# EAGLE design mp28164-buck-boost-flashlight-driver-tester-mk-2.0.0 (EAGLE 9.2.2)
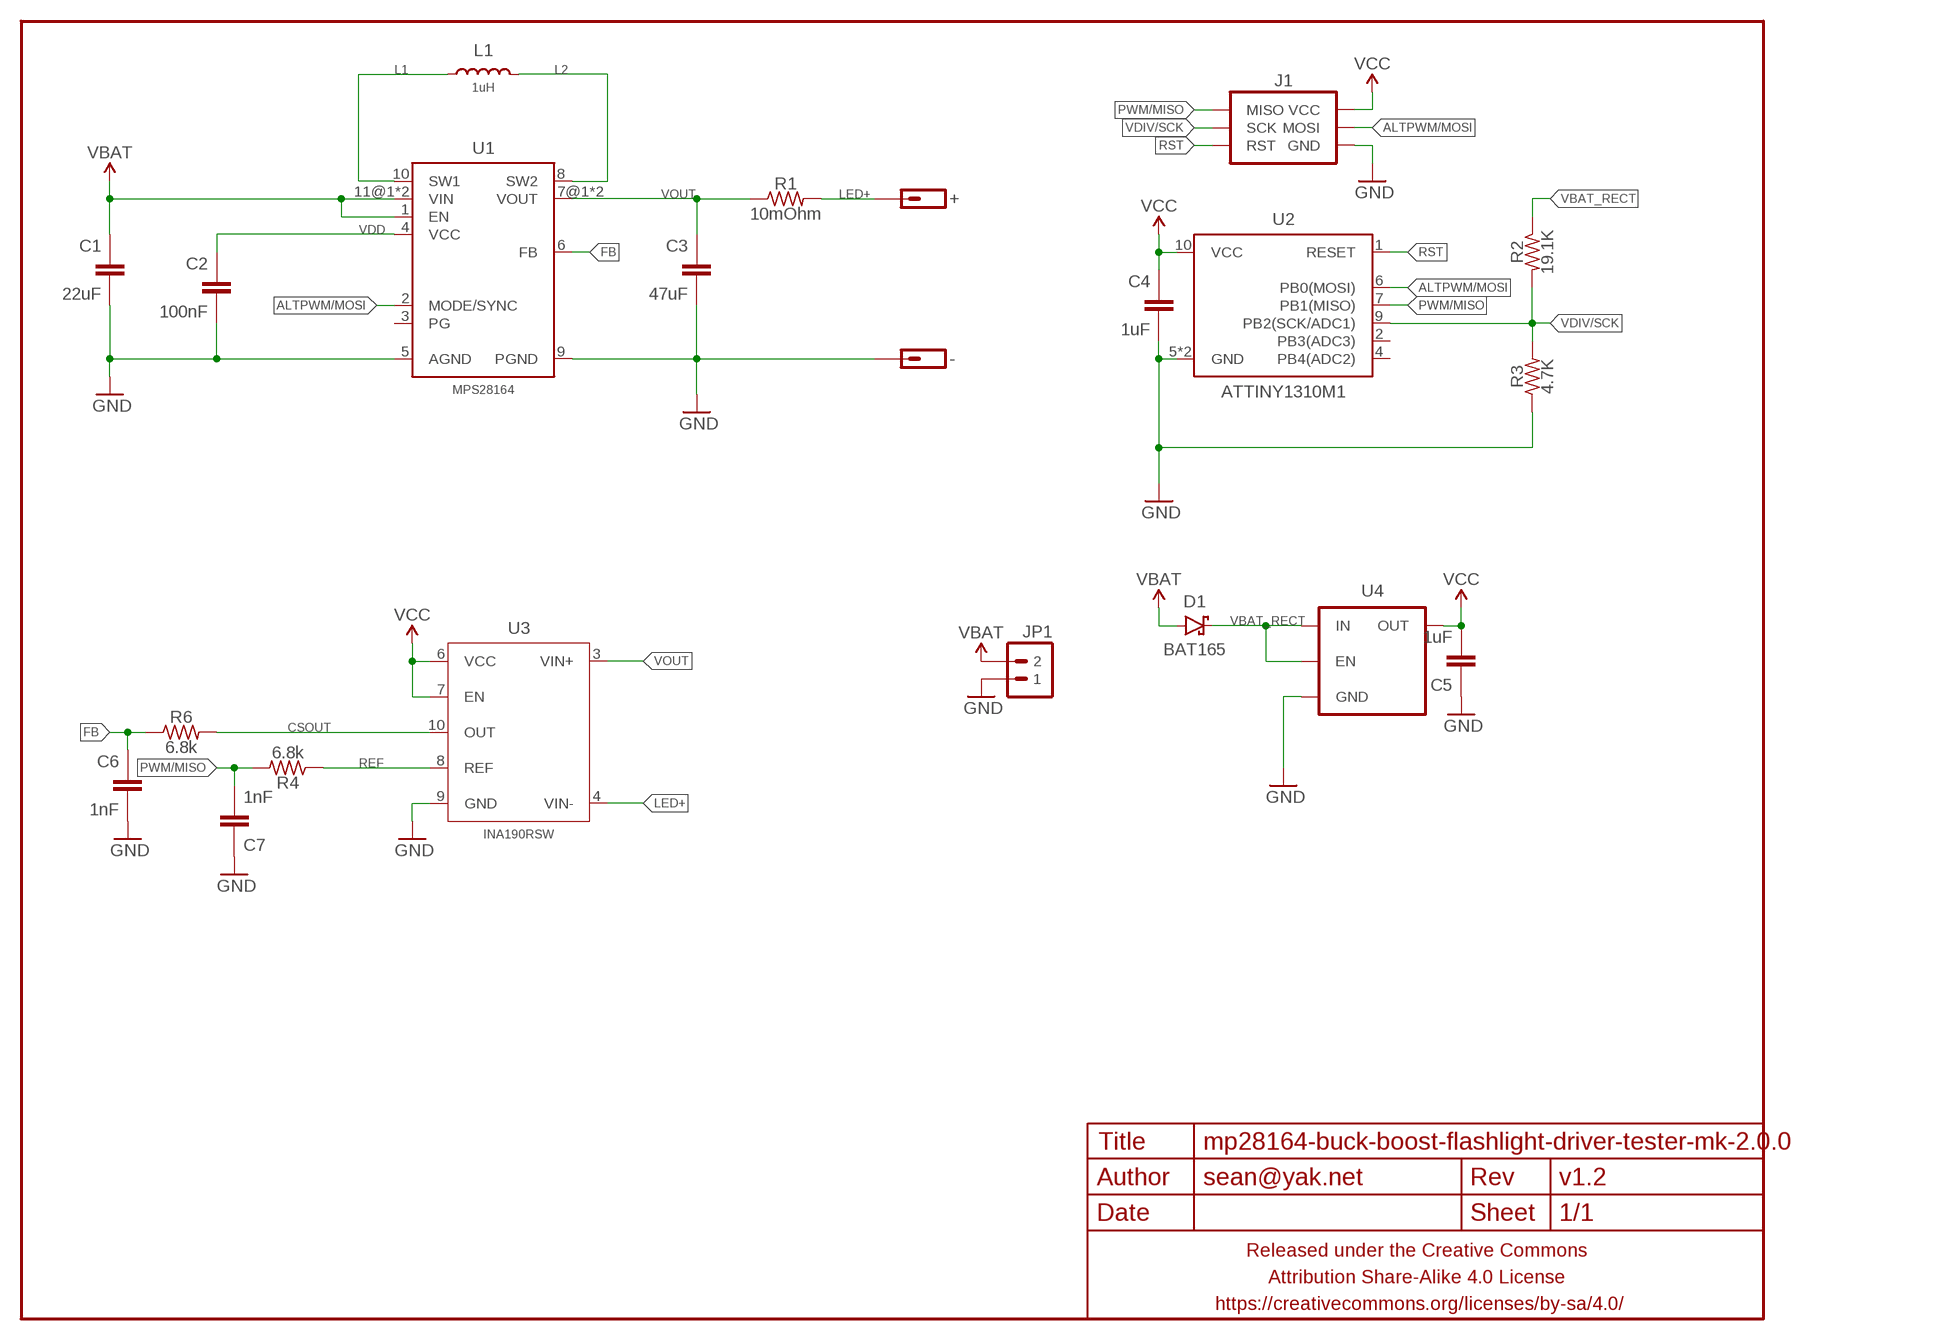
[diagram p0: schematic, sheet 1]

## Parts
+  M01PTH-1.2MM-NS  [1X01-1.2MM-NS]
-  M01PTH-1.2MM-NS  [1X01-1.2MM-NS]
C1  22uF  CAPACITOR-CERAMICC1206  [C1206]
C2  100nF  CAPACITOR-CERAMICC0402  [C0402]
C3  47uF  CAPACITOR-CERAMICC1206  [C1206]
C4  1uF  CAPACITOR-CERAMICC0402  [C0402]
C5  1uF  CAPACITOR-CERAMICC0402  [C0402]
C6  1nF  CAPACITOR-CERAMICC0402  [C0402]
C7  1nF  CAPACITOR-CERAMICC0402  [C0402]
D1  BAT165  DIODE-SCHOTTKYSOD323  [SOD323-SCHOTTKY]
FRAME1  FRAME-LETTERNO_PACKAGE  [DUMMY]
J1  AVR_SPI_PRG_6PTH  [2X3]
JP1  M02PTH  [1X02]
L1  1uH  INDUCTORXAL60XX  [XAL60XX]
R1  10mOhm  RESISTORR1206  [R1206]
R2  19.1K  RESISTORR0402  [R0402]
R3  4.7K  RESISTORR0402  [R0402]
R4  6.8k  RESISTORR0402  [R0402]
R6  6.8k  RESISTORR0402  [R0402]
U1  MPS28164  [MPS28164]
U2  ATTINY1310M1  [QFN10(2X5)]
U3  INA190RSW  [UQFN-10]
U4  V_REG_ENTLV700  [SC70]

## Nets
ALTPWM/MOSI: J1.4(MOSI) U1.2(MODE/SYNC) U2.6(PB0(MOSI))
CSOUT: R6.2 U3.10(OUT)
FB: C6.1 R6.1 U1.6(FB)
GND: -.P$1 C1.2 C2.2 C3.2 C4.2 C5.1 C6.2 C7.1 J1.6(GND) JP1.1 R3.1 U1.5(AGND) U1.9(PGND) U2.5(GND) U2.PAD(GND) U3.9(GND) U4.2(GND)
L1: L1.P$1 U1.10(SW1)
L2: L1.P$2 U1.8(SW2)
LED+: +.P$1 R1.2 U3.4(VIN-)
PWM/MISO: C7.2 J1.1(MISO) R4.2 U2.7(PB1(MISO))
REF: R4.1 U3.8(REF)
RST: J1.5(RST) U2.1(RESET)
VBAT: C1.1 D1.A JP1.2 U1.1(EN) U1.11@1(VIN) U1.11@2(VIN)
VBAT_RECT: D1.C R2.1 U4.1(IN) U4.3(EN)
VCC: C4.1 C5.2 J1.2(VCC) U2.10(VCC) U3.6(VCC) U3.7(EN) U4.5(OUT)
VDD: C2.1 U1.4(VCC)
VDIV/SCK: J1.3(SCK) R2.2 R3.2 U2.9(PB2(SCK/ADC1))
VOUT: C3.1 R1.1 U1.7@1(VOUT) U1.7@2(VOUT) U3.3(VIN+)
Unconnected: U1.3(PG) U2.2(PB3(ADC3)) U2.4(PB4(ADC2))

## Library data of the parts
+ - = a_parts:M01: Header 1 Standard 1-pin 0.1" header. Use with straight break away headers (SKU : PRT-00116), right angle break away headers (PRT-00553), swiss pins (PRT-00743), machine pins (PRT-00117), and female headers (PRT-00115).
C1-C7 = a_parts:CAPACITOR-CERAMIC: CAPACITOR, European symbol
D1 = a_parts:DIODE-SCHOTTKY: Schottky diodes in SFE's production catalog BAT20J 1A 23V 0.62Vf RB751 120mA 40V 0.37Vf PMEG4005EJ 0.5A 40V 0.42Vf MBRA140 1A 40V 0.5Vf B340A 3A 40V SMA
FRAME1 = a_parts:FRAME-LETTER: Schematic Frame Standard 8.5x11 US Letter frame; DESIGNER: sean@yak.net; VERSION: v1.2
J1 = a_parts:AVR_SPI_PRG_6: AVR ISP 6 Pin This is the reduced ISP connector for AVR programming. Common on Arduino. This footprint will take up less PCB space and can be used with a 10-pin to 6-pin adapter such as SKU: BOB-08508 **Special note about "TEST_POINT" package. The stop mask is on the top side, so if you want your programming test points to be on the bottom of your board, make sure to place this package on the bottom side of the board. This also ensure that the orientation to program from the bottom side will be correct.
JP1 = a_parts:M02: Standard 2-pin 0.1" header. Use with - straight break away headers ( PRT-00116) - right angle break away headers (PRT-00553) - swiss pins (PRT-00743) - machine pins (PRT-00117) - female headers (PRT-00115) Molex polarized connector foot print use with: PRT-08233 with associated crimp pins and housings. 2.54_SCREWTERM for use with PRT-10571. 3.5mm Screw Terminal footprints for PRT-08084 5mm Screw Terminal footprints for use with PRT-08433
L1 = a_parts:INDUCTOR: Inductors Basic Inductor/Choke - 0603 and 1206. Footprints are not proven and vary greatly between part numbers. SRN6045- 33uH, 20% 1.4A SDR0403-560KL - 56uH, 10%, 500mA RMS/740mA peak
R1-R4 R6 = a_parts:RESISTOR: RESISTOR, American symbol
U1 = a_parts:MPS28164
U2 = a_parts:ATTINY13: Atmel 8-pin 1kB flash uC
U3 = a_parts:INA190
U4 = a_parts:V_REG_EN

## Board
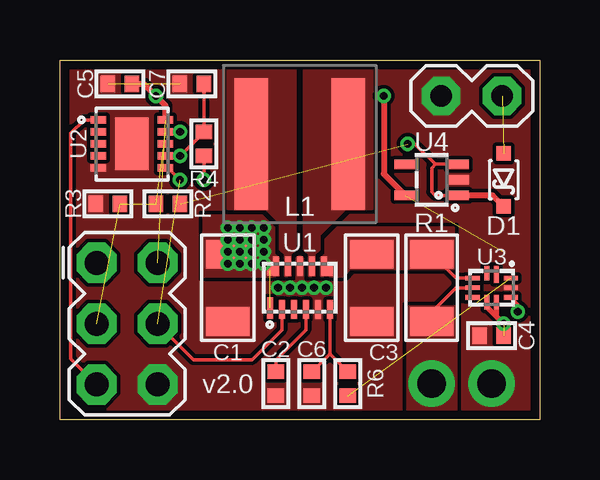
[diagram p1: board, top side]
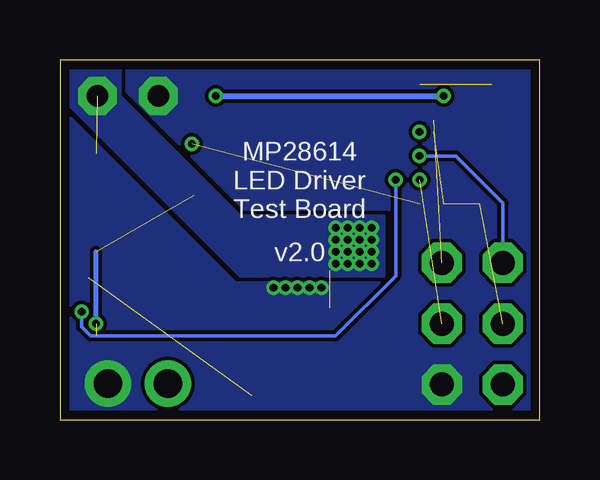
[diagram p2: board, bottom side, seen from below]

Size 20 x 15 mm. Coordinates in mm from the lower left corner, seen from the top.
Outline: 0,0 0,15 20,15 20,0 0,0
Copper layers (1*16): Top 0.035559375mm / dielectric 1.6mm / Bottom 0.035559375mm
Design rules "oshpark-2layer": minimum track width 6mil, minimum drill 10mil, track to track 6mil, track to pad 6mil, pad to pad 6mil, via to via 6mil, smd to smd 0mil, copper to edge 15mil, drill to drill 6mil, minimum pad ring 5mil, minimum via ring 5mil, stop-mask expansion 2.5mil, vias tented up to drill 20mil, thermal gap 10mil

### Footprints (pad centres in the part's own frame; a part is rotated, then mirrored left to right if it is on the bottom)
1X01-1.2MM-NS = drill 1.2 pad 1.93: P$1 0,0
C1206 = smd 1.2 x 1.8: 1 -1.4,0; 2 1.4,0
C0402 = smd 0.6 x 0.7: 1 -0.5,0; 2 0.5,0
SOD323-SCHOTTKY = smd 0.6 x 0.6: A -1.1,0; C 1.1,0
2X3 = drill 1 pad 1.676 octagon: 1 -2.54,-1.27; 2 -2.54,1.27; 3 0,-1.27; 4 0,1.27; 5 2.54,-1.27; 6 2.54,1.27
1X02 = drill 0.9 pad 1.6 octagon: 1 0,0; 2 2.54,0
XAL60XX = smd 1.4 x 5.5: P$1 -2.02,0; P$2 2.02,0
R1206 = smd 1.2 x 1.8: 1 -1.4,0; 2 1.4,0
R0402 = smd 0.6 x 0.7: 1 -0.5,0; 2 0.5,0
MPS28164 = smd 0.9 x 0.25: 1 -0.85,1.25 | smd 0.8 x 0.25: 2 -0.9,0.75; 3 -0.9,0.25; 4 -0.9,-0.25; 5 -0.9,-0.75; 6 -0.9,-1.25; 7@1 0.9,-1; 8 0.9,-0.5; 9 0.9,0; 10 0.9,0.5; 11@1 0.9,1 | smd 0.4 x 0.25: 7@2 0.7,-1.25; 11@2 0.71,1.25
QFN10(2X5) = smd 0.65 x 0.3: 1 -1.4,1; 2 -1.4,0.5; 3 -1.4,0; 4 -1.4,-0.5; 5 -1.4,-1; 6 1.4,-1; 7 1.4,-0.5; 8 1.4,0; 9 1.4,0.5; 10 1.4,1 | smd 1.4 x 2.2: PAD 0,0
UQFN-10 = smd 0.2 x 0.7: 1 -0.2,-0.55 | smd 0.2 x 0.6: 2 0.2,-0.6; 6 0.2,0.6; 7 -0.2,0.6 | smd 0.6 x 0.2: 3 0.8,-0.4; 4 0.8,0; 5 0.8,0.4; 8 -0.8,0.4; 9 -0.8,0; 10 -0.8,-0.4
SC70 = smd 0.4 x 0.9: 1 -0.65,-1.1; 2 0,-1.1; 3 0.65,-1.1; 4 0.65,1.1; 5 -0.65,1.1

### Placement (x,y rotation side)
+  15.5,1.5 0 top
-  18,1.5 0 top
C1  7,5.5 270 top
C2  9,1.5 270 top
C3  13,5.5 270 top
C4  18,3.5 180 top
C5  2.5,14 0 top
C6  10.5,1.5 270 top
C7  5.5,14 0 top
D1  18.5,10 270 top
FRAME1  0,0 0 top
J1  2.8,4 270 top
JP1  15.9,13.5 0 top
L1  10,11.5 0 top
R1  15.5,5.5 270 top
R2  4.5,9 180 top
R3  2,9 0 top
R4  6,11.5 90 top
R6  12,1.5 270 top
U1  10,5.5 90 top
U2  3,11.5 0 top
U3  18,5.5 180 top
U4  15.5,10 90 top

### Tracks (layer width: path | path; a pad name or v marks a point on that pad's centre or on a via)
ALTPWM/MOSI  (via drill 0.33)  (1 unrouted)
  Top 0.152: U2.6 4.5,10.5 v5,10 | U1.2 9.25,3.75 8,2.5 5.57,2.5 J1.4
CSOUT  (1 unrouted)
FB
  Top 0.152: U1.6 11.25,2.75 | 11.25,2.75 C6.1 | R6.1 11.25,2.75
GND  (via drill 0.33)  (1 unrouted)
  other vias: 10.1,5.5 9.6,5.5 9.1,5.5 10.6,5.5 11.1,5.5
  pour Top (rank 6, no thermals): 0,0 20,0 20,15 0,15
  pour Bottom (rank 6, no thermals): 20,0 0,0 0,15 20,15
L1
  pour Top (rank 4, no thermals): 9.4,6 9.4,6.9 9.2,7.1 9.2,8.2 8.6,8.8 7,8.8 7,15 9.8,15 9.8,7.1 9.6,6.9 9.6,6
L2
  pour Top (rank 4, no thermals): 10.4,6 10.4,6.9 10.2,7.1 10.2,15 13,15 13,8.8 11.9,8.8 10.8,7.7 10.8,7.1 10.6,6.9 10.6,6
LED+
  Top 0.152: R1.2 15.5,4.5 16.5,5.5 U3.4
  pour Top (rank 5, no thermals): 14.5,4.7 14.5,0 16.5,0 16.5,4.7
PWM/MISO  (via drill 0.33)
  Top 0.152: U2.7 v5,11 R4.2 C7.2
  Bottom 0.152: J1.1 1.53,9.03 3.5,11 v5,11
REF  (via drill 0.33)
  Top 0.152: U3.8 19.1,4.8 v19.1,4.5 | R4.1 v6,10
  Bottom 0.152: v6,10 6,6 8.52,3.48 18.72,3.48 19.1,3.86 v19.1,4.5
RST
  Top 0.152: J1.5 0.46,2.53 0.46,11.96 1,12.5 U2.1
VBAT  (via drill 0.33)  (2 unrouted)
  other vias: 8.5,7 8.5,7.5 8,7.5 8,7 7.5,7 7.5,7.5 7.5,8 8,8 8.5,8 7.5,6.5 8,6.5 8.5,6.5 7,8 7,7.5 7,7 7,6.5
  pour Bottom (rank 5, no thermals): 6.5,8.5 6.5,6 9,6 12.5,6 20,13.5 20,15 17.5,15 17.5,13.5 12.5,8.5
  pour Top (rank 5, no thermals): 6,8.5 9,8.5 9,6.9 9.1,6.8 9.1,6 6,6
VBAT_RECT  (via drill 0.33)  (1 unrouted)
  Top 0.152: U4.3 15.65,10.65 | 15.65,10.65 15.5,10.5 15.5,9.5 15.65,9.35 U4.1 | 15.65,10.65 14.8,11.5 v14.5,11.5
  Top 0.25: D1.C 18.05,9.35 U4.1
VCC  (via drill 0.33)  (3 unrouted)
  Top 0.2: U3.7 18.2,4.3 | 18.2,4.3 v18.5,4 | U3.6 17.8,4.7 18.2,4.3
  Top 0.25: C5.2 3.5,14 v4,13.5 4.4,13.1 U2.10 | v13.5,13.5 13.5,10.25 U4.5
  Bottom 0.2: v18.5,4 18.5,7
  Bottom 0.25: v13.5,13.5 v4,13.5
VDD
  Top 0.152: U1.4 10.25,3.75 9,2.5 C2.1
VDIV/SCK  (via drill 0.33)  (3 unrouted)
  Top 0.152: U2.9 v5,12
VOUT
  Top 0.152: R1.1 16.5,5.9 U3.3
  pour Top (rank 5, no thermals): 10.9,6 10.9,8 16.4,8 16.4,6.3 12.1,6.3 11.8,6

### Text on the board
bPlace: MP28614 / LED Driver / Test Board